# Altium schematic sheet ZYNQ_TOP_LEVEL.SchDoc
size A4; DocumentNumber: 41; SheetNumber: 41; SheetTotal: 47
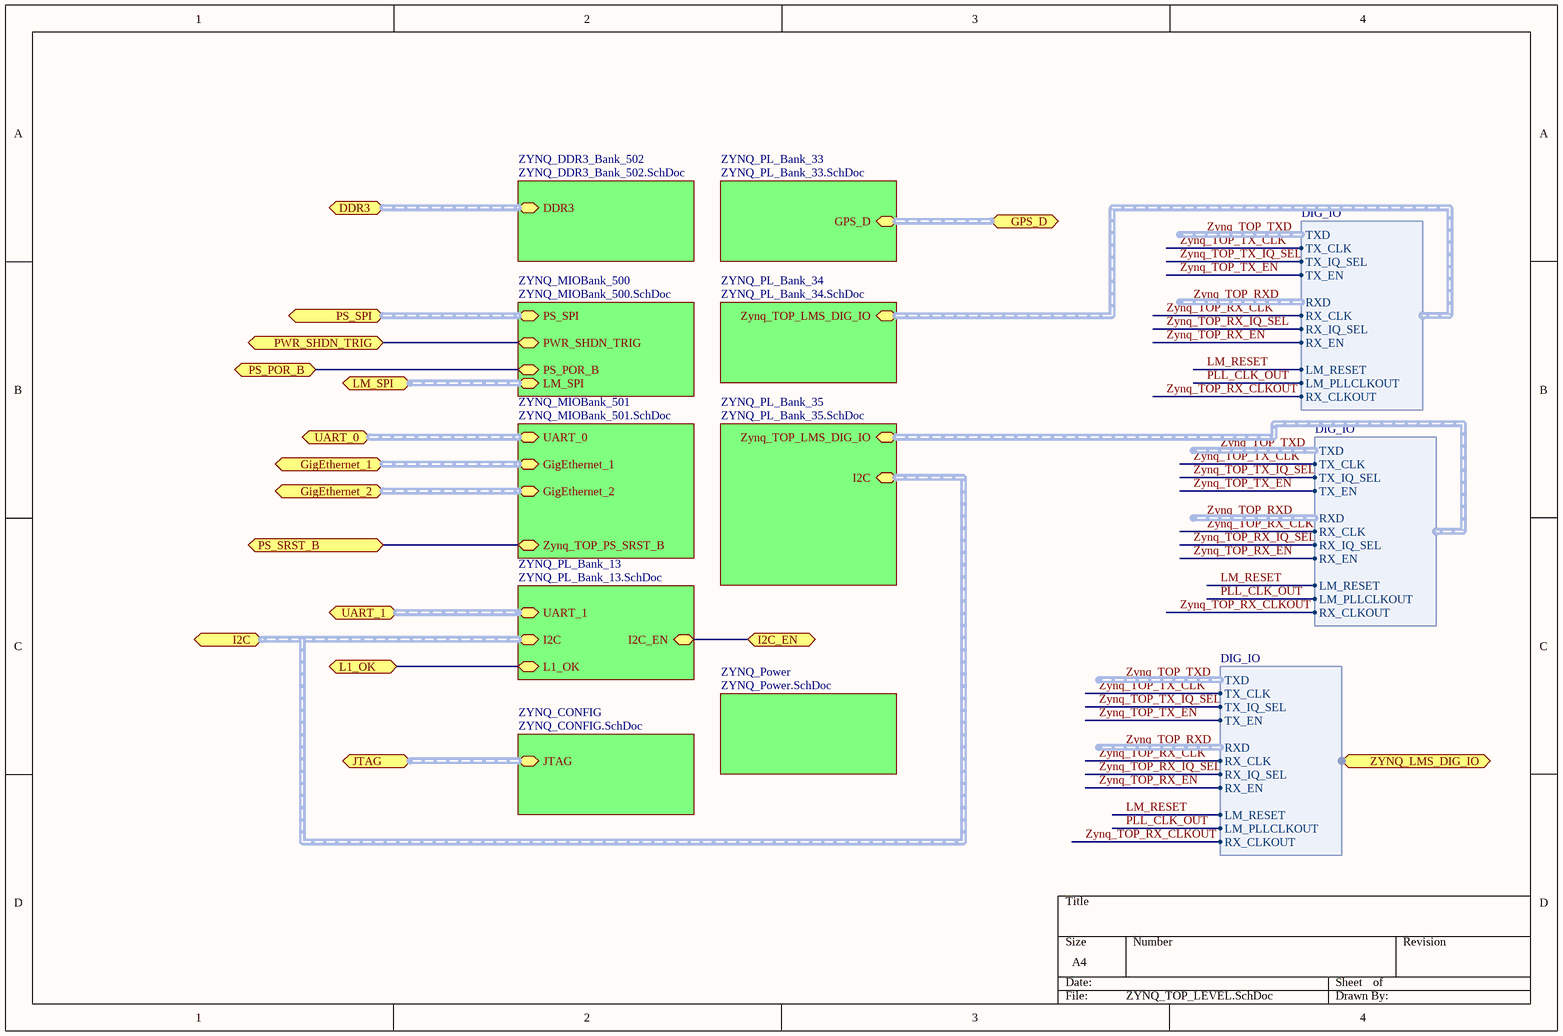
[diagram p0: ZYNQ_TOP_LEVEL.SchDoc]

## Sub-sheets
ZYNQ_CONFIG = ZYNQ_CONFIG.SchDoc: JTAG (harness JTAG)
ZYNQ_DDR3_Bank_502 = ZYNQ_DDR3_Bank_502.SchDoc: DDR3 (harness DDR3)
ZYNQ_MIOBank_500 = ZYNQ_MIOBank_500.SchDoc: PS_SPI (harness SPI), PS_POR_B (bidir), PWR_SHDN_TRIG (bidir), LM_SPI (harness LM_SPI)
ZYNQ_MIOBank_501 = ZYNQ_MIOBank_501.SchDoc: UART_0 (harness UART_0), GigEthernet_1 (harness Gig_Ethernet1), GigEthernet_2 (harness Gig_Ethernet2), Zynq_TOP_PS_SRST_B (bidir)
ZYNQ_PL_Bank_13 = ZYNQ_PL_Bank_13.SchDoc: UART_1 (harness UART_1), I2C (harness I2C), L1_OK, I2C_EN
ZYNQ_PL_Bank_33 = ZYNQ_PL_Bank_33.SchDoc: GPS_D (harness GPS)
ZYNQ_PL_Bank_34 = ZYNQ_PL_Bank_34.SchDoc: Zynq_TOP_LMS_DIG_IO (harness DIG_IO)
ZYNQ_PL_Bank_35 = ZYNQ_PL_Bank_35.SchDoc: Zynq_TOP_LMS_DIG_IO (harness DIG_IO), I2C (harness I2C)
ZYNQ_Power = ZYNQ_Power.SchDoc: no entries

## Ports
DDR3 (harness DDR3), GigEthernet_1 (harness Gig_Ethernet1), GigEthernet_2 (harness Gig_Ethernet2), GPS_D (harness GPS), I2C (harness I2C), I2C_EN (bidir), JTAG (harness JTAG), L1_OK, LM_SPI (harness LM_SPI), PS_POR_B (bidir), PS_SPI (harness SPI), PS_SRST_B (bidir), PWR_SHDN_TRIG (bidir), UART_0 (harness UART_0), UART_1 (harness UART_1), ZYNQ_LMS_DIG_IO (harness DIG_IO)

## Harnesses
DIG_IO: TXD, TX_CLK, TX_IQ_SEL, TX_EN, RXD, RX_CLK, RX_IQ_SEL, RX_EN, LM_RESET, LM_PLLCLKOUT, RX_CLKOUT

## Nets
I2C_EN: port I2C_EN, sheet ZYNQ_PL_Bank_13/I2C_EN
L1_OK: port L1_OK, sheet ZYNQ_PL_Bank_13/L1_OK
LM_RESET: sheet ZYNQ_PL_Bank_34/Zynq_TOP_LMS_DIG_IO.LM_RESET, sheet ZYNQ_PL_Bank_35/Zynq_TOP_LMS_DIG_IO.LM_RESET, port ZYNQ_LMS_DIG_IO.LM_RESET
PLL_CLK_OUT: sheet ZYNQ_PL_Bank_34/Zynq_TOP_LMS_DIG_IO.LM_PLLCLKOUT, sheet ZYNQ_PL_Bank_35/Zynq_TOP_LMS_DIG_IO.LM_PLLCLKOUT, port ZYNQ_LMS_DIG_IO.LM_PLLCLKOUT
PS_POR_B: port PS_POR_B, sheet ZYNQ_MIOBank_500/PS_POR_B
PS_SRST_B: port PS_SRST_B, sheet ZYNQ_MIOBank_501/Zynq_TOP_PS_SRST_B
PWR_SHDN_TRIG: port PWR_SHDN_TRIG, sheet ZYNQ_MIOBank_500/PWR_SHDN_TRIG
Zynq_TOP_RX_CLK: sheet ZYNQ_PL_Bank_34/Zynq_TOP_LMS_DIG_IO.RX_CLK, sheet ZYNQ_PL_Bank_35/Zynq_TOP_LMS_DIG_IO.RX_CLK, port ZYNQ_LMS_DIG_IO.RX_CLK
Zynq_TOP_RX_CLKOUT: sheet ZYNQ_PL_Bank_34/Zynq_TOP_LMS_DIG_IO.RX_CLKOUT, sheet ZYNQ_PL_Bank_35/Zynq_TOP_LMS_DIG_IO.RX_CLKOUT, port ZYNQ_LMS_DIG_IO.RX_CLKOUT
Zynq_TOP_RX_EN: sheet ZYNQ_PL_Bank_34/Zynq_TOP_LMS_DIG_IO.RX_EN, sheet ZYNQ_PL_Bank_35/Zynq_TOP_LMS_DIG_IO.RX_EN, port ZYNQ_LMS_DIG_IO.RX_EN
Zynq_TOP_RX_IQ_SEL: sheet ZYNQ_PL_Bank_34/Zynq_TOP_LMS_DIG_IO.RX_IQ_SEL, sheet ZYNQ_PL_Bank_35/Zynq_TOP_LMS_DIG_IO.RX_IQ_SEL, port ZYNQ_LMS_DIG_IO.RX_IQ_SEL
Zynq_TOP_TX_CLK: sheet ZYNQ_PL_Bank_34/Zynq_TOP_LMS_DIG_IO.TX_CLK, sheet ZYNQ_PL_Bank_35/Zynq_TOP_LMS_DIG_IO.TX_CLK, port ZYNQ_LMS_DIG_IO.TX_CLK
Zynq_TOP_TX_EN: sheet ZYNQ_PL_Bank_34/Zynq_TOP_LMS_DIG_IO.TX_EN, sheet ZYNQ_PL_Bank_35/Zynq_TOP_LMS_DIG_IO.TX_EN, port ZYNQ_LMS_DIG_IO.TX_EN
Zynq_TOP_TX_IQ_SEL: sheet ZYNQ_PL_Bank_34/Zynq_TOP_LMS_DIG_IO.TX_IQ_SEL, sheet ZYNQ_PL_Bank_35/Zynq_TOP_LMS_DIG_IO.TX_IQ_SEL, port ZYNQ_LMS_DIG_IO.TX_IQ_SEL

## Buses and harness runs
harness port DDR3 = sheet ZYNQ_DDR3_Bank_502/DDR3
harness port GigEthernet_1 = sheet ZYNQ_MIOBank_501/GigEthernet_1
harness port GigEthernet_2 = sheet ZYNQ_MIOBank_501/GigEthernet_2
harness port GPS_D = sheet ZYNQ_PL_Bank_33/GPS_D
harness port I2C = sheet ZYNQ_PL_Bank_13/I2C = sheet ZYNQ_PL_Bank_35/I2C
harness port JTAG = sheet ZYNQ_CONFIG/JTAG
harness port LM_SPI = sheet ZYNQ_MIOBank_500/LM_SPI
harness port PS_SPI = sheet ZYNQ_MIOBank_500/PS_SPI
harness port UART_0 = sheet ZYNQ_MIOBank_501/UART_0
harness port UART_1 = sheet ZYNQ_PL_Bank_13/UART_1